# EAGLE schematic PCB2_forDIY (EAGLE 9.5.2)
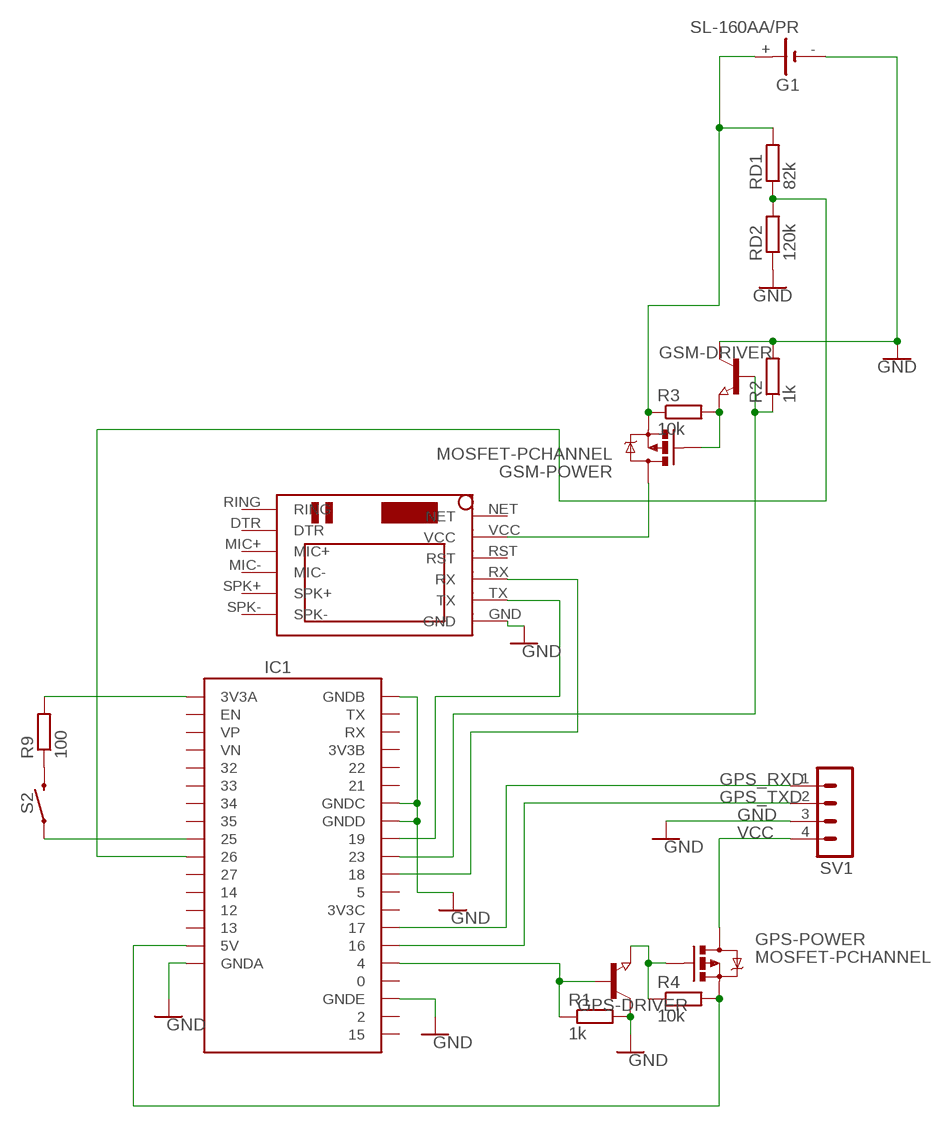
[diagram p0: schematic, sheet 1]

## Parts
G1  SL-160AA/PR  [SL-160AA/PR]
GPS-DRIVER  NPN-TRANSISTOR_SOT23  [SOT23]
GPS-POWER  MOSFET-PCHANNEL  [SOT23-3]
GSM-DRIVER  NPN-TRANSISTOR_SOT23  [SOT23]
GSM-POWER  MOSFET-PCHANNEL  [SOT23-3]
IC1  SSFD_LOLIN32_WEMOS_CHINA_W_BATT  [SSFD_LOLIN32_WEMOS_CHINA_W_BATT]
R1  1k  RR0402  [R0402]
R2  1k  RR0402  [R0402]
R3  10k  RR0603  [R0603]
R4  10k  RR0603  [R0603]
R9  100  RR0603  [R0603]
RD1  82k  RR0402  [R0402]
RD2  120k  RR0402  [R0402]
S2  MOMENTARY-SWITCH-SPST-SMD-6.0X3.5MM  [TACTILE_SWITCH_SMD_6.0X3.5MM]
SV1  MA04-1  [MA04-1]
U$1  SIM800LMODULE  [SIM800LMODULE]

## Nets
5/SCL: GPS-DRIVER.1(B) IC1.4 R1.1
5V: GPS-POWER.2(S) IC1.5V R4.2
A0: IC1.26 RD1.1 RD2.2
CS/TXD2: GSM-DRIVER.1(B) IC1.23 R2.1
GND: G1.- GPS-DRIVER.3(C) GSM-DRIVER.3(C) IC1.GNDA IC1.GNDB IC1.GNDC IC1.GNDD IC1.GNDE R1.2 R2.2 RD2.1 SV1.3 U$1.GND
GPS_RXD: IC1.17 SV1.1
GPS_TXD: IC1.16 SV1.2
N$1: R9.1 S2.2
N$2: GPS-DRIVER.2(E) GPS-POWER.1(G) R4.1
N$3: G1.+ GSM-POWER.2(S) R3.1 RD1.2
N$4: GSM-POWER.3(D) U$1.VCC
N$5: GSM-DRIVER.2(E) GSM-POWER.1(G) R3.2
N$6: IC1.18 U$1.RX
N$7: IC1.19 U$1.TX
N$8: IC1.3V3A R9.2
N$9: IC1.25 S2.1
VCC: GPS-POWER.3(D) SV1.4
Unconnected: IC1.0 IC1.2 IC1.3V3B IC1.3V3C IC1.5 IC1.12 IC1.13 IC1.14 IC1.15 IC1.21 IC1.22 IC1.27 IC1.32 IC1.33 IC1.34 IC1.35 IC1.EN IC1.RX IC1.TX IC1.VN IC1.VP U$1.DTR U$1.MIC+ U$1.MIC- U$1.NET U$1.RING U$1.RST U$1.SPK+ U$1.SPK-

## Library data of the parts
G1 = battery:SL-160AA/PR: LI BATTERY Sonnenschein
GPS-DRIVER GSM-DRIVER = semicon-smd-ipc:NPN-TRANSISTOR_: NPN TRANSISTOR
GPS-POWER GSM-POWER = User-Submitted:MOSFET-PCHANNEL: Generic PMOSFET IRLML2244 - TRANS-11153 (SOT-23 -20V -4.3A) (1.Gate 2.Source 3.Drain) FQP27P06 - COM-10349 <http://www.sparkfun.com/products/10349> (TO-220 -60V -27A) (1.Gate 2.Source 3.Drain); PROD_ID: TRANS-08285
IC1 = SSFD - ESP32 WEMOS LOLIN CHINA W_BATT:SSFD_LOLIN32_WEMOS_CHINA_W_BATT: BY SEGASONICFAN DESIGNS HTTP://WWW.SEGASONICFAN.WIXSITE.COM/RETRO WEMOS ESP32 BREAKOUT 4MB CHINA WITH BATTERY CONNECTOR https://arduino-projekte.info/wemos-lolin32/ https://diyprojects.io/wemos-lolin32-new-development-board-esp32-e645-4mb-memory-lipo-battery-connector/
R1-R4 R9 RD1 RD2 = eagle-ltspice:R: RESISTOR, European symbol; SPICEMODEL: NONE; SPICEPREFIX: R
S2 = SparkFun-Switches:MOMENTARY-SWITCH-SPST: Momentary Switch (Pushbutton) - SPST Normally-open (NO) SPST momentary switches (buttons, pushbuttons). Variants PTH-12MM - 12mm square, through-hole Momentary Pushbutton Switch - 12mm Square <https://www.sparkfun.com/products/9190> (COM-09190) PTH-6.0MM, PTH-6.0MM-KIT - 6.0mm square, through-hole Mini Pushbutton Switch <https://www.sparkfun.com/products/97> (COM-00097) KIT package intended for soldering kit's - only one side of pads' copper is exposed. PTH-RIGHT-ANGLE-KIT - Right-angle, through-hole Right Angle Tactile Button <https://www.sparkfun.com/products/10791> - Used on SparkFun BigTime Watch Kit <https://www.sparkfun.com/products/11734> SMD-12MM - 12mm square, surface-mount Tactile Button - SMD (12mm) <https://www.sparkfun.com/products/12993> (COM-12993) Used on SparkFun PicoBoard <https://www.sparkfun.com/products/11888> SMD-4.5MM - 4.5mm Square Trackball Switch Used on SparkFun Blackberry Trackballer Breakout <https://www.sparkfun.com/products/13169> SMD-4.6MMX2.8MM - 4.60mm x 2.80mm, surface mount Used on SparkFun SAMD21 Mini Breakout <https://www.sparkfun.com/products/13664> SMD-5.2MM, SMD-5.2-REDUNDANT - 5.2mm square, surface-mount Mini Pushbutton Switch - SMD <https://www.sparkfun.com/products/8720> (COM-08720) Used on Arduino Pro Mini <https://www.sparkfun.com/products/11114> REDUNDANT package connects both switch circuits together SMD-6.0X3.5MM - 6.0 x 3.5mm, surface mount Momentary Reset Switch SMD <https://www.sparkfun.com/products/8229> (COM-08229) SMD-6.2MM-TALL - 6.2mm square, surface mount Tactile Button - SMD (6mm) <https://www.sparkfun.com/products/12992> Used on SparkFun Digital Sandbox <https://www.sparkfun.com/products/12651> SMD-RIGHT-ANGLE - Right-angle, surface mount Used on SparkFun Block for Intel® Edison - Arduino <https://www.sparkfun.com/products/13036>; PROD_ID: SWCH-14278; SF_SKU: COM-08229
SV1 = con-lstb:MA04-1: PIN HEADER; OC_FARNELL: unknown; OC_NEWARK: unknown
U$1 = SIM800LMODULE:SIM800LMODULE: SIM800L Module